# EAGLE design master_jetson_connection (EAGLE 9.6.2)
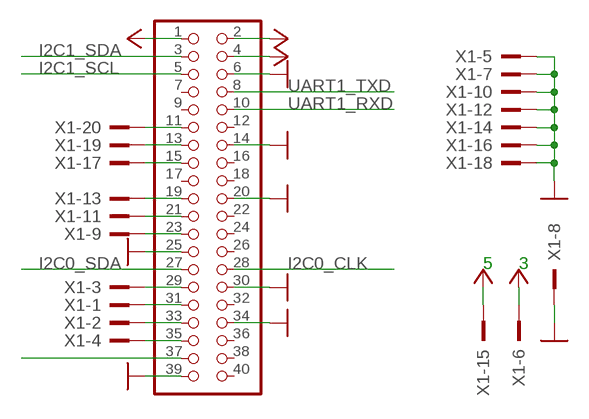
[diagram p0: schematic, sheet 1]

## Parts
JP1  PINHD-2X20  [2X20]
X1  2520-  [PAK100/2500-20]

## Nets
+3V3: JP1.1 X1.6
+5V: JP1.2 JP1.4 X1.15
GND: JP1.6 JP1.14 JP1.20 JP1.25 JP1.30 JP1.34 JP1.39 X1.5 X1.7 X1.8 X1.10 X1.12 X1.14 X1.16 X1.18
I2C0_CLK: JP1.28
I2C0_SDA: JP1.27
I2C1_SCL: JP1.5
I2C1_SDA: JP1.3
N$6: JP1.11 X1.20
N$7: JP1.13 X1.19
N$8: JP1.15 X1.17
N$10: JP1.19 X1.13
N$11: JP1.21 X1.11
N$12: JP1.23 X1.9
N$15: JP1.29 X1.3
N$16: JP1.31 X1.1
N$17: JP1.33 X1.2
N$18: JP1.37
N$19: JP1.35 X1.4
UART1_RXD: JP1.10
UART1_TXD: JP1.8
Unconnected: JP1.7 JP1.9 JP1.12 JP1.16 JP1.17 JP1.18 JP1.22 JP1.24 JP1.26 JP1.32 JP1.36 JP1.38 JP1.40

## Notes on the sheet
- 5 | 3

## Library data of the parts
JP1 = pinhead:PINHD-2X20: PIN HEADER
X1 = con-3m:2520-: 3M (TM) Pak 100 4-Wall Header Source: 3M; OC_FARNELL: unknown; OC_NEWARK: unknown

## Board
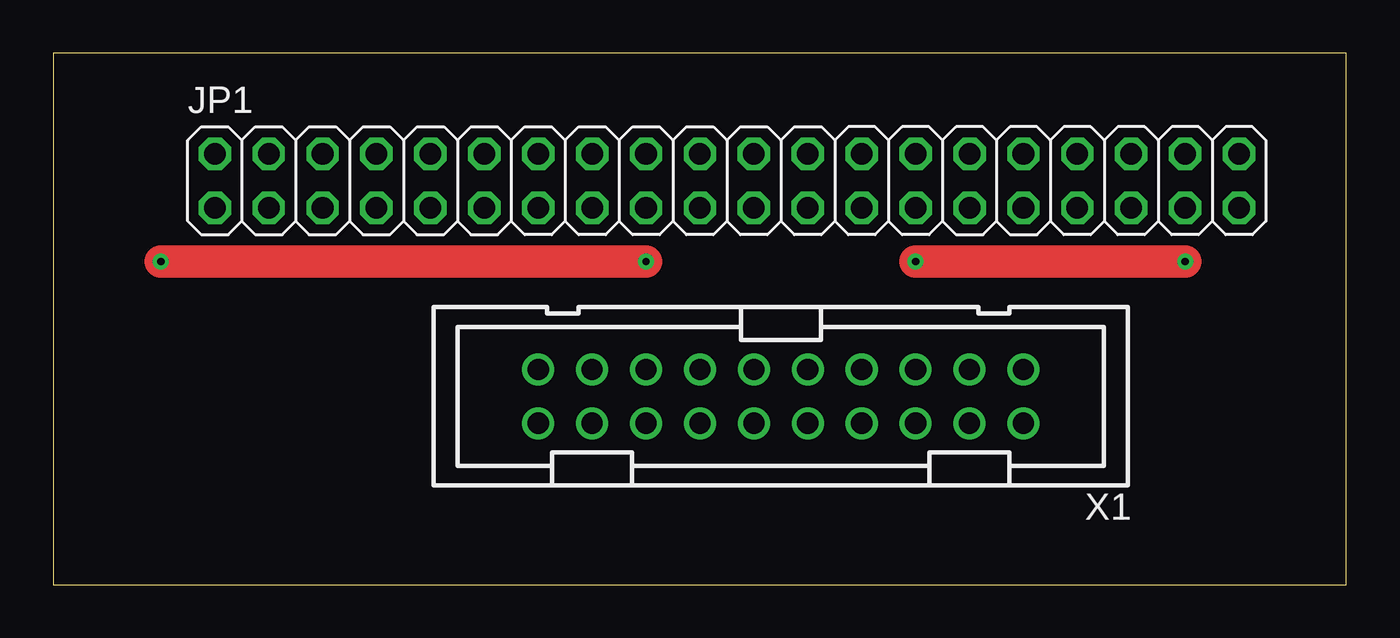
[diagram p1: board, top side]
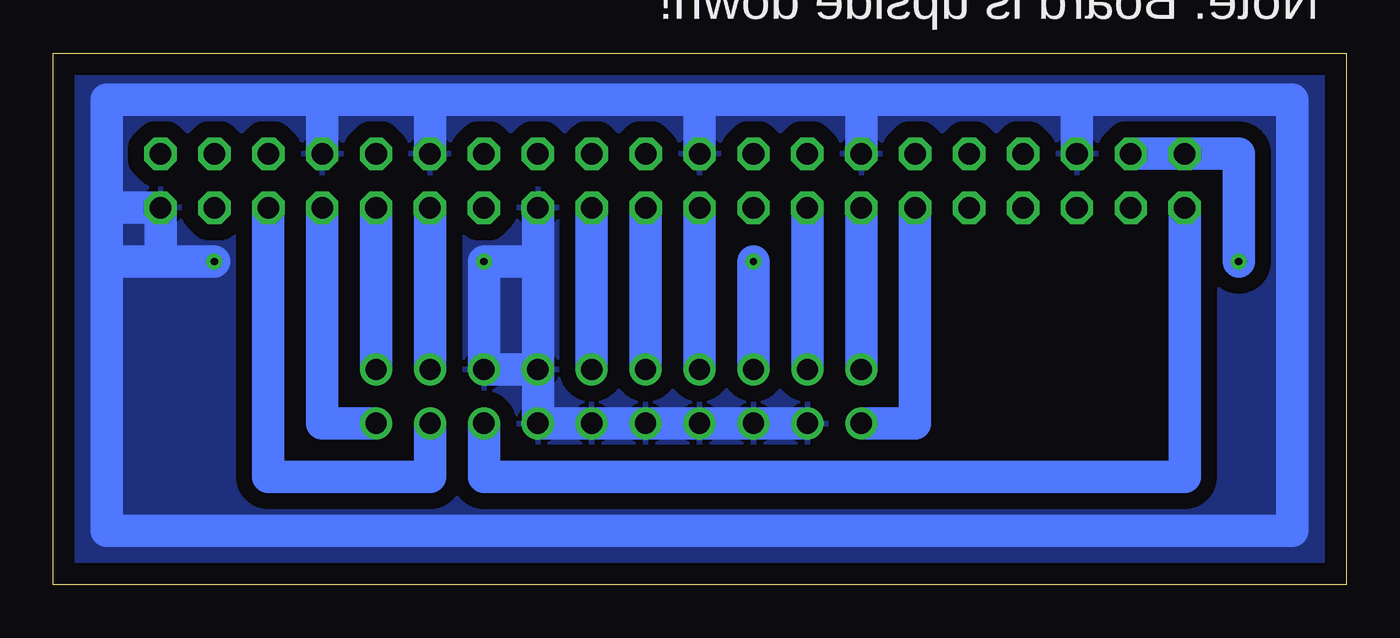
[diagram p2: board, bottom side, seen from below]

Size 60.94 x 25.07 mm. Coordinates in mm from the lower left corner, seen from the top.
Outline: 0,0 60.94,0 60.94,25.07 0,25.07 0,0
Copper layers (1*16): Top 0.035mm / dielectric 1.5mm / Bottom 0.035mm
Design rules "default": minimum track width 6mil, minimum drill 0.35mm, track to track 6mil, track to pad 6mil, pad to pad 6mil, via to via 6mil, smd to smd 6mil, copper to edge 40mil, drill to drill 6mil, minimum pad ring 10mil, minimum via ring 8mil, stop-mask expansion 4mil, vias tented up to drill 0mil, thermal gap 10mil

### Footprints (pad centres in the part's own frame; a part is rotated, then mirrored left to right if it is on the bottom)
2X20 = drill 1.016 octagon: 1 -24.13,-1.27; 2 -24.13,1.27; 3 -21.59,-1.27; 4 -21.59,1.27; 5 -19.05,-1.27; 6 -19.05,1.27; 7 -16.51,-1.27; 8 -16.51,1.27; 9 -13.97,-1.27; 10 -13.97,1.27; 11 -11.43,-1.27; 12 -11.43,1.27; 13 -8.89,-1.27; 14 -8.89,1.27; 15 -6.35,-1.27; 16 -6.35,1.27; 17 -3.81,-1.27; 18 -3.81,1.27; 19 -1.27,-1.27; 20 -1.27,1.27; 21 1.27,-1.27; 22 1.27,1.27; 23 3.81,-1.27; 24 3.81,1.27; 25 6.35,-1.27; 26 6.35,1.27; 27 8.89,-1.27; 28 8.89,1.27; 29 11.43,-1.27; 30 11.43,1.27; 31 13.97,-1.27; 32 13.97,1.27; 33 16.51,-1.27; 34 16.51,1.27; 35 19.05,-1.27; 36 19.05,1.27; 37 21.59,-1.27; 38 21.59,1.27; 39 24.13,-1.27; 40 24.13,1.27
PAK100/2500-20 = drill 1 pad 1.422: 1 -11.43,-1.27; 2 -11.43,1.27; 3 -8.89,-1.27; 4 -8.89,1.27; 5 -6.35,-1.27; 6 -6.35,1.27; 7 -3.81,-1.27; 8 -3.81,1.27; 9 -1.27,-1.27; 10 -1.27,1.27; 11 1.27,-1.27; 12 1.27,1.27; 13 3.81,-1.27; 14 3.81,1.27; 15 6.35,-1.27; 16 6.35,1.27; 17 8.89,-1.27; 18 8.89,1.27; 19 11.43,-1.27; 20 11.43,1.27

### Placement (x,y rotation side)
JP1  31.75,19.05 0 top
X1  34.29,8.89 180 top

### Tracks (layer width: path | path; a pad name or v marks a point on that pad's centre or on a via)
+3V3
  Bottom 1.524: X1.6 40.64,5.08 7.62,5.08 JP1.1
+5V  (via drill 0.35)
  Top 1.524: v5.08,15.24 17.78,15.24 v27.94,15.24
  Bottom 1.524: JP1.4 JP1.2 5.08,20.32 v5.08,15.24 | X1.15 v27.94,15.24
GND  (via drill 0.35)
  Top 1.524: v40.64,15.24 v53.34,15.24
  Bottom 1.524: X1.18 X1.16 X1.14 X1.12 X1.10 X1.8 X1.7 | X1.7 X1.5 v40.64,15.24 38.1,15.24 | JP1.25 38.1,15.24 | X1.7 38.1,15.24 | 55.88,15.24 JP1.39 58.42,17.78 | 55.88,15.24 v53.34,15.24 | 55.88,15.24 58.42,15.24 | 58.42,17.78 58.42,22.86 48.26,22.86 | 58.42,17.78 58.42,15.24 | 48.26,22.86 43.18,22.86 | 43.18,22.86 30.48,22.86 | 30.48,22.86 22.86,22.86 | 22.86,22.86 12.7,22.86 | JP1.6 12.7,22.86 | JP1.14 22.86,22.86 | JP1.20 30.48,22.86 | JP1.30 43.18,22.86 | JP1.34 48.26,22.86 | 12.7,22.86 2.54,22.86 2.54,2.54 58.42,2.54 58.42,15.24
  pour Bottom (isolate 0.762): 0,0 60.96,0 60.96,25.15 0,25.15
N$6
  Bottom 1.524: JP1.11 20.32,7.62 X1.20
N$7
  Bottom 1.524: JP1.13 X1.19
N$8
  Bottom 1.524: JP1.15 X1.17
N$10
  Bottom 1.524: JP1.19 X1.13
N$11
  Bottom 1.524: JP1.21 X1.11
N$12
  Bottom 1.524: JP1.23 X1.9
N$15
  Bottom 1.524: JP1.29 X1.3
N$16
  Bottom 1.524: JP1.31 X1.1
N$17
  Bottom 1.524: JP1.33 48.26,7.62 X1.2
N$19
  Bottom 1.524: JP1.35 50.8,5.08 43.18,5.08 43.18,5.95 X1.4

### Text on the board
bNames: Note: Board is upside down!